# Altium schematic sheet GD_interface.SchDoc
size A4
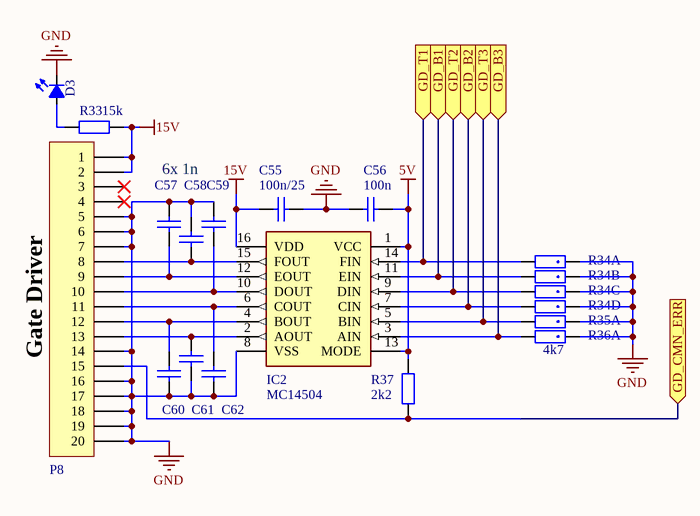
[diagram p0: GD_interface.SchDoc]

## Parts
C55  100n/25  [C_0603]
C56  100n  [C_0603]
C57  1n  [C_0603]  (value not drawn)
C58  1n  [C_0603]  (value not drawn)
C59  1n  [C_0603]  (value not drawn)
C60  1n  [C_0603]  (value not drawn)
C61  1n  [C_0603]  (value not drawn)
C62  1n  [C_0603]  (value not drawn)
D3  Green  [D0603]  (value not drawn)
IC2  MC14504  [SOP65P640X120-16N]
P8  GD  [TE_MicroMatch_20_SMD_Female]  (value not drawn)
R33  15k  [R_0603]
R34  1k  [R_Array  4D03]  (value not drawn)  (parts A,B,C,D of 4)
R35  1k  [R_Array  4D03]  (value not drawn)  (part A of 4)
R36  4k7  [R_Array  4D03]  (part A of 4)
R37  2k2  [R_0603]

## Ports
GD_B1 (in), GD_B2 (in), GD_B3 (in), GD_CMN_ERR (in), GD_T1 (in), GD_T2 (in), GD_T3 (in)

## Nets
5V: C56.2 IC2.1(VCC) IC2.13(MODE) R37.1
15V: C55.1 IC2.16(VDD) P8.1 P8.2 R33.2
GND: C55.2 C56.1 C57.2 C58.2 C59.2 C60.1 C61.1 C62.1 D3.1(K) IC2.8(VSS) P8.5 P8.6 P8.7 P8.14 P8.16 P8.17 P8.18 P8.19 P8.20 R34.1 R34.2 R34.3 R34.4 R35.1 R36.1
GD_B1: IC2.11(EIN) R34.7 ; port GD_B1
GD_B2: IC2.7(CIN) R34.5 ; port GD_B2
GD_B3: IC2.3(AIN) R36.8 ; port GD_B3
GD_CMN_ERR: P8.15 R37.2 ; port GD_CMN_ERR
GD_T1: IC2.14(FIN) R34.8 ; port GD_T1
GD_T2: IC2.9(DIN) R34.6 ; port GD_T2
GD_T3: IC2.5(BIN) R35.8 ; port GD_T3
NetC57_1: C57.1 IC2.12(EOUT) P8.9
NetC58_1: C58.1 IC2.15(FOUT) P8.8
NetC59_1: C59.1 IC2.10(DOUT) P8.10
NetC60_2: C60.2 IC2.4(BOUT) P8.12
NetC61_2: C61.2 IC2.6(COUT) P8.11
NetC62_2: C62.2 IC2.2(AOUT) P8.13
NetD3_2: D3.2(A) R33.1

Not connected (* = marked no-connect by the designer): P8 3* 4*

## Notes on the sheet
- 6x 1n
- (near P8) Gate Driver

## Library data of the parts
C55-C62 = C_MLCC: cond
  C55: Value: 100n/25
  C56: Value: 100n
  C57-C62: Value: 1n
D3 = D_LED small: LED diode
IC2 = IC_MC14504: Level shifter; Manufacturer_Name: ON Semiconductor; Manufacturer_Part_Number: MC14504BDTG; Allied_Number: 70466282; Datasheet Link: http://www.onsemi.com/pub/Collateral/MC14504B-D.PDF; Height: 1.2mm; Mouser Part Number: 863-MC14504BDTG; Mouser Price/Stock: https://www.mouser.com/Search/Refine.aspx?Keyword=863-MC14504BDTG; RS Part Number: 8063258; RS Price/Stock: https://uk.rs-online.com/web/p/products/8063258; Allied Price/Stock: http://www.alliedelec.com/on-semiconductor-mc14504bdtg/70466282/; ComponentLink1Description: Datasheet; ComponentLink1URL: https://www.mouser.sk/datasheet/2/308/MC14504B-D-103983.pdf
P8 = Header 20: Te connectivity Micro Match: 2-338069-0; Manufacturer: Tyco; Order number: 2-338069-0 or 9-338069-0; ComponentLink1Description: TE website; ComponentLink1URL: https://www.te.com/usa-en/product-2-338069-0.html
R33 R37 = R_Uni: Resistor
  R33: Value: 15k
  R37: Value: 2k2
R34-R36 = R_Array 4xR: Resistor array 4xR,  size 1206, 64mW; Name_: Michal Minarik; Wattage: 1/16W; Working voltage: 50V; DATE_: 10.5.2018